# EAGLE design PSU-Control (EAGLE 8.2.0)
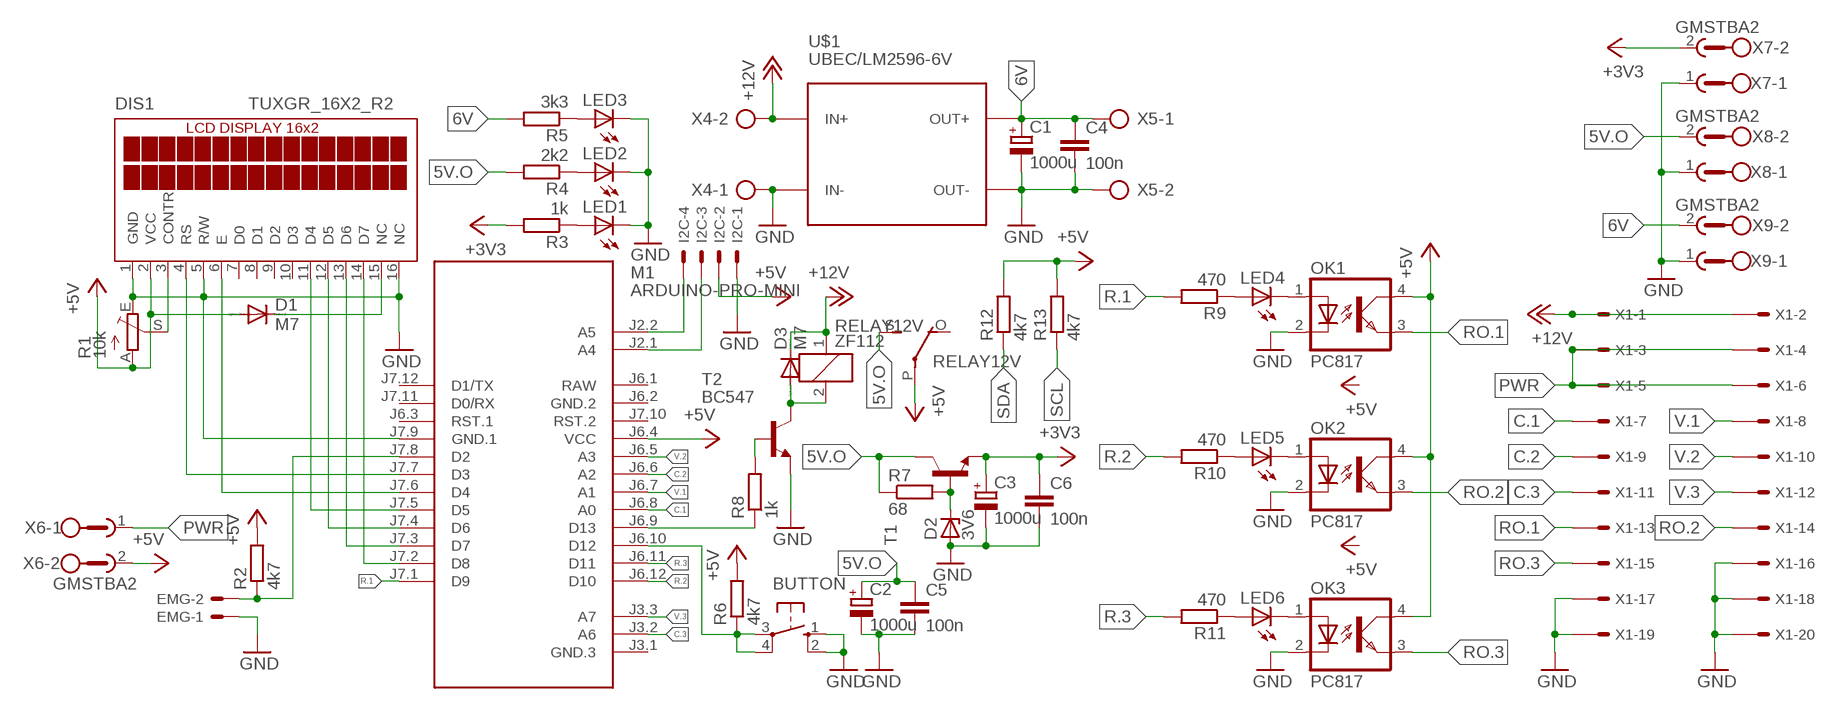
[diagram p0: schematic, sheet 1]

## Parts
BUTTON  40-XX  [B3F-40XX]
C1  1000u  CPOL-EUE5-10.5  [E5-10,5]
C2  1000u  CPOL-EUE5-10.5  [E5-10,5]
C3  1000u  CPOL-EUE5-10.5  [E5-10,5]
C4  100n  C-EUC0805K  [C0805K]
C5  100n  C-EUC0805K  [C0805K]
C6  100n  C-EUC0805K  [C0805K]
D1  M7  DIODE-DO214AA  [DO214AA]
D2  3V6  ZENER-DIODEZD-7.5  [ZDIO-7.5]
D3  M7  DIODE-DO214AA  [DO214AA]
DIS1  TUXGR_16X2_R2  [TUXGR_16X2_R2]
EMG  22-23-2021  [22-23-2021]
I2C  22-23-2041  [22-23-2041]
LED1  LEDCHIPLED_1206  [CHIPLED_1206]
LED2  LEDCHIPLED_1206  [CHIPLED_1206]
LED3  LEDCHIPLED_1206  [CHIPLED_1206]
LED4  LEDCHIPLED_1206  [CHIPLED_1206]
LED5  LEDCHIPLED_1206  [CHIPLED_1206]
LED6  LEDCHIPLED_1206  [CHIPLED_1206]
M1  ARDUINO-PRO-MINI  ARDUINO-PRO-MINI-5.0V#NP  [ARDUINO-PRO-MINI#NP]
OK1  PC817  [DIL04]
OK2  PC817  [DIL04]
OK3  PC817  [DIL04]
R1  10k  TRIM_EU-RJ9W  [RJ9W]
R2  4k7  R-EU_R0805  [R0805]
R3  1k  R-EU_R0805  [R0805]
R4  2k2  R-EU_R0805  [R0805]
R5  3k3  R-EU_R0805  [R0805]
R6  4k7  R-EU_R0805  [R0805]
R7  68  R-EU_R0805  [R0805]
R8  1k  R-EU_R0805  [R0805]
R9  470  R-EU_R0805  [R0805]
R10  470  R-EU_R0805  [R0805]
R11  470  R-EU_R0805  [R0805]
R12  4k7  R-EU_R0805  [R0805]
R13  4k7  R-EU_R0805  [R0805]
RELAY12V  ZF112  [ZF112]
T1  -NPN-TO220V  [TO220V]
T2  BC547  [TO92]
U$1  UBEC/LM2596-6V  DC-DC-STEP-DOWN-LM2596  [DC-DC-STEP-DOWN-LM2596]
X1  057-020-1  [057-020-1]
X4  AK300/2  [AK300/2]
X5  AK300/2  [AK300/2]
X6  GMSTBA2  [GMSTBA2]
X7  GMSTBA2  [GMSTBA2]
X8  GMSTBA2  [GMSTBA2]
X9  GMSTBA2  [GMSTBA2]

## Nets
5V.O: C2.+ C5.1 R4.2 R7.1 RELAY12V.S(2:S) T1.2(C) X8.2
6V: C1.+ C4.1 R5.2 U$1.OUT+ X5.1 X9.2
+3V3: C3.+ C6.1 R3.2 T1.3(E) X7.2
+5V: D1.A DIS1.2(VCC) I2C.2 M1.J6.4(VCC) OK1.4(COL) OK2.4(COL) OK3.4(COL) R1.A R2.2 R6.2 R12.2 R13.2 RELAY12V.P(2:P) X6.2
+12V: D3.C RELAY12V.1 U$1.IN+ X1.1 X1.2 X4.2
C.1: M1.J6.8(A0) X1.7
C.2: M1.J6.6(A2) X1.9
C.3: M1.J3.2(A6) X1.11
GND: BUTTON.1(S) BUTTON.2(S1) C1.- C2.- C3.- C4.2 C5.2 C6.2 D2.A DIS1.1(GND) DIS1.5(R/W) DIS1.16(NC) EMG.1 I2C.1 LED1.C LED2.C LED3.C M1.J7.9(GND.1) OK1.2(C) OK2.2(C) OK3.2(C) R1.E T2.1(E) U$1.IN- U$1.OUT- X1.16 X1.17 X1.18 X1.19 X1.20 X4.1 X5.2 X7.1 X8.1 X9.1
N$1: EMG.2 M1.J7.8(D2) R2.1
N$2: D1.C DIS1.15(NC)
N$3: DIS1.4(RS) M1.J7.7(D3)
N$4: DIS1.3(CONTR) R1.S
N$5: DIS1.6(E) M1.J7.6(D4)
N$6: DIS1.11(D4) M1.J7.5(D5)
N$7: LED4.C OK1.1(A)
N$8: LED5.A R10.1
N$9: DIS1.12(D5) M1.J7.4(D6)
N$10: DIS1.13(D6) M1.J7.3(D7)
N$11: DIS1.14(D7) M1.J7.2(D8)
N$12: BUTTON.3(P) BUTTON.4(P1) M1.J6.10(D12) R6.1
N$13: LED1.A R3.1
N$14: LED2.A R4.1
N$15: LED3.A R5.1
N$16: D2.C R7.2 T1.1(B)
N$17: LED5.C OK2.1(A)
N$18: D3.A RELAY12V.2 T2.3(C)
N$19: M1.J6.9(D13) R8.1
N$20: R8.2 T2.2(B)
N$21: LED6.A R11.1
N$22: LED4.A R9.1
N$23: LED6.C OK3.1(A)
PWR: X1.3 X1.4 X1.5 X1.6 X6.1
R.1: M1.J7.1(D9) R9.2
R.2: M1.J6.12(D10) R10.2
R.3: M1.J6.11(D11) R11.2
RO.1: OK1.3(EMIT) X1.13
RO.2: OK2.3(EMIT) X1.14
RO.3: OK3.3(EMIT) X1.15
SCL: I2C.4 M1.J2.2(A5) R13.1
SDA: I2C.3 M1.J2.1(A4) R12.1
V.1: M1.J6.7(A1) X1.8
V.2: M1.J6.5(A3) X1.10
V.3: M1.J3.3(A7) X1.12
Unconnected: DIS1.7(D0) DIS1.8(D1) DIS1.9(D2) DIS1.10(D3) M1.J3.1(GND.3) M1.J6.3(RST.1) M1.J7.10(RST.2) M1.J7.11(D0/RX) M1.J7.12(D1/TX) RELAY12V.O(2:O)

## Power pins joined to a net without a drawn wire
GND.2: M1.J6.2(GND.2)
RAW: M1.J6.1(RAW)

## Library data of the parts
BUTTON = switch-omron:40-XX: OMRON SWITCH; MF: OMRON COMPONENTS USA; MPN: B3F-4000; OC_FARNELL: 176434; OC_NEWARK: 36K3105
C1-C3 = rcl:CPOL-EU: POLARIZED CAPACITOR, European symbol
C4-C6 = rcl:C-EU: CAPACITOR, European symbol
D1 D3 = diode:DIODE-: DIODE
D2 = diode:ZENER-DIODE: Z-Diode
DIS1 = display-lcd:TUXGR_16X2_R2: Tuxgraphics LCD display 16x2 characters reflective, without background light Source: tuxgr_12x2_r2.pdf; OC_FARNELL: unknown; OC_NEWARK: unknown
EMG = con-molex:22-23-2021: .100" (2.54mm) Center Header - 2 Pin; MF: MOLEX; MPN: 22-23-2021; OC_FARNELL: 1462926; OC_NEWARK: 25C3832
I2C = con-molex:22-23-2041: .100" (2.54mm) Center Header - 4 Pin; MF: MOLEX; MPN: 22-23-2041; OC_FARNELL: 1462920; OC_NEWARK: 38C0355
LED1-LED6 = led:LED: LED OSRAM: - CHIPLED LG R971, LG N971, LY N971, LG Q971, LY Q971, LO R971, LY R971 LH N974, LH R974 LS Q976, LO Q976, LY Q976 LO Q996 - Hyper CHIPLED LW Q18S LB Q993, LB Q99A, LB R99A - SideLED LS A670, LO A670, LY A670, LG A670, LP A670 LB A673, LV A673, LT A673, LW A673 LH A674 LY A675 LS A676, LA A676, LO A676, LY A676, LW A676 LS A679, LY A679, LG A679 - Hyper Micro SIDELED® LS Y876, LA Y876, LO Y876, LY Y876 LT Y87S - SmartLED LW L88C, LW L88S LB L89C, LB L89S, LG L890 LS L89K, LO L89K, LY L89K LS L896, LA L896, LO L896, LY L896 - TOPLED LS T670, LO T670, LY T670, LG T670, LP T670 LSG T670, LSP T670, LSY T670, LOP T670, LYG T670 LG T671, LOG T671, LSG T671 LB T673, LV T673, LT T673, LW T673 LH T674 LS T676, LA T676, LO T676, LY T676, LB T676, LH T676, LSB T676, LW T676 LB T67C, LV T67C, LT T67C, LS T67K, LO T67K, LY T67K, LW E67C LS E67B, LA E67B, LO E67B, LY E67B, LB E67C, LV E67C, LT E67C LW T67C LS T679, LY T679, LG T679 LS T770, LO T770, LY T770, LG T770, LP T770 LB T773, LV T773, LT T773, LW T773 LH T774 LS E675, LA E675, LY E675, LS T675 LS T776, LA T776, LO T776, LY T776, LB T776 LHGB T686 LT T68C, LB T68C - Hyper Mini TOPLED® LB M676 - Mini TOPLED Santana® LG M470 LS M47K, LO M47K, LY M47K Source: http://www.osram.convergy.de LUXEON: - LUMILED® LXK2-PW12-R00, LXK2-PW12-S00, LXK2-PW14-U00, LXK2-PW14-V00 LXK2-PM12-R00, LXK2-PM12-S00, LXK2-PM14-U00 LXK2-PE12-Q00, LXK2-PE12-R00, LXK2-PE12-S00, LXK2-PE14-T00, LXK2-PE14-U00 LXK2-PB12-K00, LXK2-PB12-L00, LXK2-PB12-M00, LXK2-PB14-N00, LXK2-PB14-P00, LXK2-PB14-Q00 LXK2-PR12-L00, LXK2-PR12-M00, LXK2-PR14-Q00, LXK2-PR14-R00 LXK2-PD12-Q00, LXK2-PD12-R00, LXK2-PD12-S00 LXK2-PH12-R00, LXK2-PH12-S00 LXK2-PL12-P00, LXK2-PL12-Q00, LXK2-PL12-R00 Source: www.luxeon.com KINGBRIGHT: KA-3528ASYC Source: www.kingbright.com
M1 = diy-modules:ARDUINO-PRO-MINI-*#NP: Arduino Pro Mini (and compatible devices) without programming pads More details available here: https://www.arduino.cc/en/Main/ArduinoBoardProMini Click here to find device on ebay.com <http://www.ebay.com/sch/arduino+pro+mini>
OK1-OK3 = optocoupler:PC817: SHARP OPTO COUPLER; MPN: PC817X4J000F; OC_FARNELL: 9707727; OC_NEWARK: 97K7059
R1 = pot:TRIM_EU-: POTENTIOMETER
R2-R13 = rcl:R-EU_: RESISTOR, European symbol
RELAY12V = relay:ZF112: RELAY 1 x switch; OC_FARNELL: unknown; OC_NEWARK: unknown
T1 = transistor:*-NPN-: NPN Transistror BF959 corrected 2008.03.06
T2 = transistor:BC547: NPN TRANSISTOR
U$1 = diy-modules:DC-DC-STEP-DOWN-LM2596: DC/DC Step-Down Regulator based on LM2596-ADJ chip LM2596 datasheet available here: http://www.ti.com/lit/ds/symlink/lm2596.pdf Click here to find device on ebay.com <http://www.ebay.com/sch/lm2596+power+regulator>
X1 = con-panduit:057-020-: CONNECTOR 20-pin series 057 contact pc board low profile headers; OC_FARNELL: unknown; OC_NEWARK: unknown
X4 X5 = con-ptr500:AK300/2: CONNECTOR; OC_FARNELL: unknown; OC_NEWARK: unknown
X6-X9 = con-phoenix-762:GMSTBA2: PHOENIX; MF: FARNELL; MPN: 1757242; OC_FARNELL: 3705171; OC_NEWARK: 71C4161

## Board
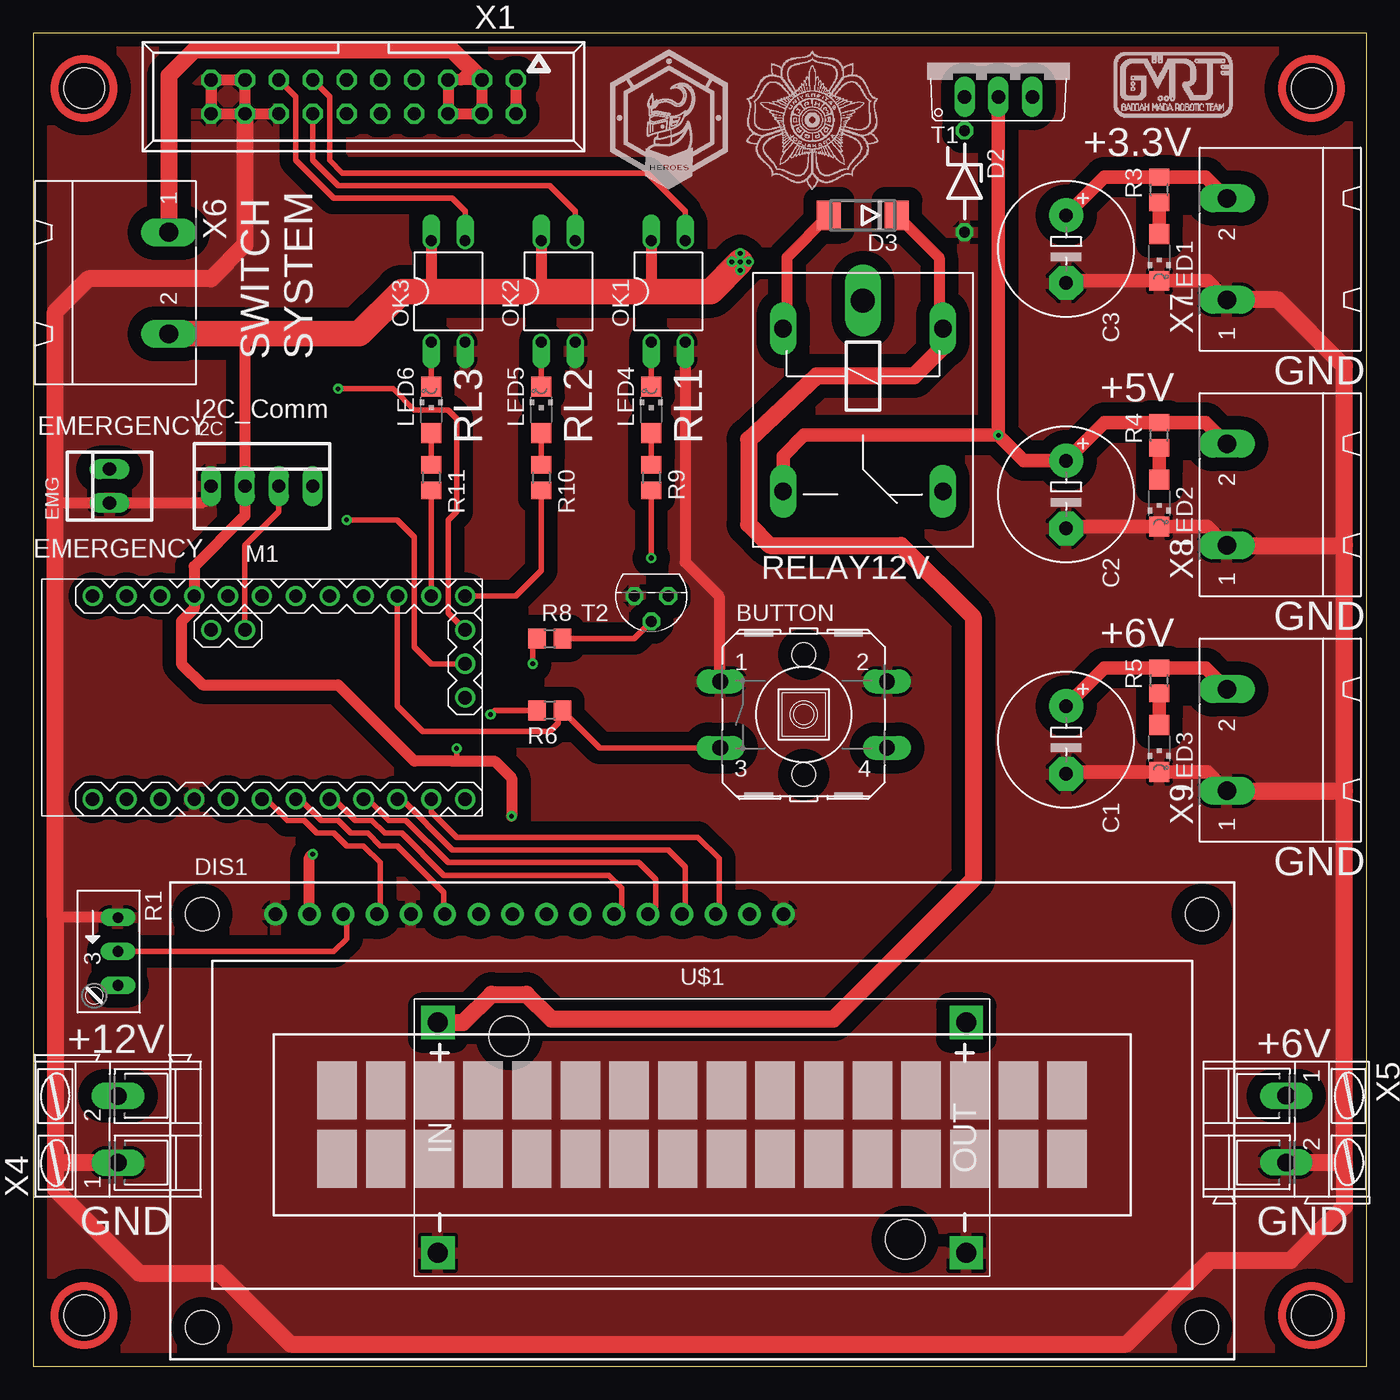
[diagram p1: board, top side]
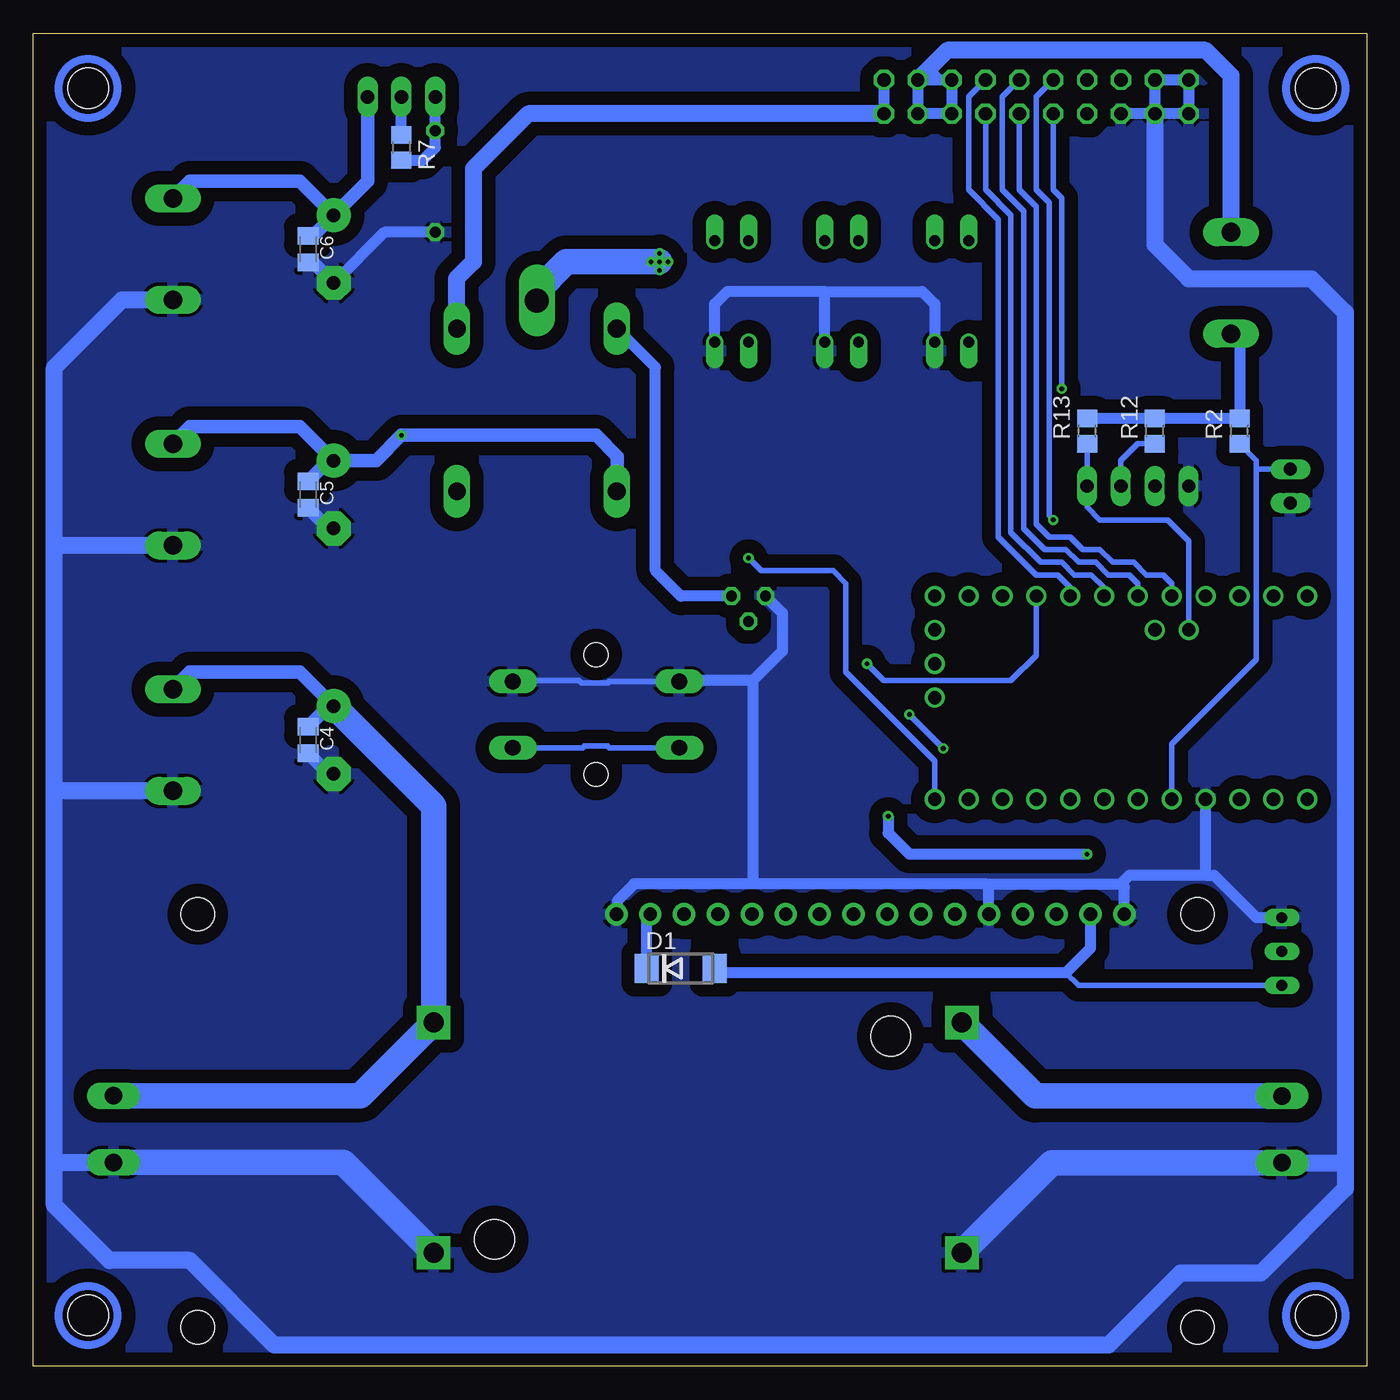
[diagram p2: board, bottom side, seen from below]

Size 100 x 100 mm. Coordinates in mm from the lower left corner, seen from the top.
Outline: 0,0 100,0 100,100 0,100 0,0
Copper layers (1*16): Top 0.035mm / dielectric 1.5mm / Bottom 0.035mm
Design rules "default": minimum track width 6mil, minimum drill 0.35mm, track to track 6mil, track to pad 6mil, pad to pad 6mil, via to via 6mil, smd to smd 6mil, copper to edge 40mil, drill to drill 6mil, minimum pad ring 10mil, minimum via ring 8mil, stop-mask expansion 4mil, vias tented up to drill 0mil, thermal gap 10mil

### Footprints (pad centres in the part's own frame; a part is rotated, then mirrored left to right if it is on the bottom)
B3F-40XX = drill 1.194 long: 1 -6.248,2.489; 2 6.248,2.489; 3 -6.248,-2.489; 4 6.248,-2.489 | hole 1.803: 0,-4.496; 0,4.496
E5-10,5 = drill 1.016 pad 2.54: + -2.54,0 | drill 1.016 pad 2.54 octagon: - 2.54,0
C0805K = smd 1.3 x 1.6: 1 -1,0; 2 1,0
DO214AA = smd 1.8 x 2.2: A 2.55,0; C -2.55,0
ZDIO-7.5 = drill 0.813 octagon: A 3.81,0; C -3.81,0
TUXGR_16X2_R2 = drill 1 pad 1.676: 1 -32,15.5; 2 -29.46,15.5; 3 -26.92,15.5; 4 -24.38,15.5; 5 -21.84,15.5; 6 -19.3,15.5; 7 -16.76,15.5; 8 -14.22,15.5; 9 -11.68,15.5; 10 -9.14,15.5; 11 -6.6,15.5; 12 -4.06,15.5; 13 -1.52,15.5; 14 1.02,15.5; 15 3.56,15.5; 16 6.1,15.5 | hole 2.5: -37.5,-15.5; 37.5,-15.5; -37.5,15.5; 37.5,15.5
22-23-2021 = drill 1 long: 1 -1.27,0; 2 1.27,0
22-23-2041 = drill 1 long: 1 -3.81,0; 2 -1.27,0; 3 1.27,0; 4 3.81,0
CHIPLED_1206 = smd 1.5 x 1.5: A 0,-1.75; C 0,1.75
ARDUINO-PRO-MINI#NP = drill 1: J2.1 -1.27,5.08; J2.2 -3.81,5.08; J3.1 15.24,0; J3.2 15.24,2.54; J3.3 15.24,5.08; J6.1 -12.7,7.62; J6.2 -10.16,7.62; J6.3 -7.62,7.62; J6.4 -5.08,7.62; J6.5 -2.54,7.62; J6.6 0,7.62; J6.7 2.54,7.62; J6.8 5.08,7.62; J6.9 7.62,7.62; J6.10 10.16,7.62; J6.11 12.7,7.62; J6.12 15.24,7.62; J7.1 15.24,-7.62; J7.2 12.7,-7.62; J7.3 10.16,-7.62; J7.4 7.62,-7.62; J7.5 5.08,-7.62; J7.6 2.54,-7.62; J7.7 0,-7.62; J7.8 -2.54,-7.62; J7.9 -5.08,-7.62; J7.10 -7.62,-7.62; J7.11 -10.16,-7.62; J7.12 -12.7,-7.62
DIL04 = drill 0.813 offset: 1 -1.27,-3.81; 2 1.27,-3.81; 3 1.27,3.81; 4 -1.27,3.81
RJ9W = drill 0.813 long: A 2.54,0.635; E -2.54,0.635; S 0,0.635
R0805 = smd 1.3 x 1.5: 1 -0.95,0; 2 0.95,0
ZF112 = drill 1.321 long: 1 -6.096,5.994; 2 -6.096,-5.994; O 6.096,5.994; S 6.096,-5.994 | drill 1.803 long: P -8.204,0
TO220V = drill 1.016 long: 1 -2.54,-2.54; 2 0,-2.54; 3 2.54,-2.54
TO92 = drill 0.813 octagon: 1 1.27,0; 2 0,1.905; 3 -1.27,0
DC-DC-STEP-DOWN-LM2596 = drill 1.5 pad 2.5 square: IN+ -19.812,8.636; IN- -19.812,-8.636; OUT+ 19.812,8.636; OUT- 19.812,-8.636 | hole 3: -14.478,7.62; 15.24,-7.62
HOLE-3MM = hole 3.05: 0,0
057-020-1 = drill 1 octagon: 1 -11.43,-1.27; 2 -11.43,1.27; 3 -8.89,-1.27; 4 -8.89,1.27; 5 -6.35,-1.27; 6 -6.35,1.27; 7 -3.81,-1.27; 8 -3.81,1.27; 9 -1.27,-1.27; 10 -1.27,1.27; 11 1.27,-1.27; 12 1.27,1.27; 13 3.81,-1.27; 14 3.81,1.27; 15 6.35,-1.27; 16 6.35,1.27; 17 8.89,-1.27; 18 8.89,1.27; 19 11.43,-1.27; 20 11.43,1.27
AK300/2 = drill 1.321 long: 1 -2.515,0; 2 2.489,0
GMSTBA2 = drill 1.397 long: 1 -3.81,5.08; 2 3.81,5.08

### Placement (x,y rotation side)
BUTTON  57.78,48.9 0 top
C1  77.47,46.99 270 top
C2  77.47,65.41 270 top
C3  77.47,83.82 270 top
C4  79.38,46.99 270 bottom
C5  79.38,65.41 270 bottom
C6  79.38,83.82 270 bottom
D1  51.43,29.84 0 bottom
D2  69.85,88.9 270 top
D3  62.23,86.36 180 top
DIS1  50.16,18.41 0 top
EMG  5.71,66.04 90 top
I2C  17.14,66.04 0 top
LED1  84.45,83.19 180 top
LED2  84.45,64.77 180 top
LED3  84.45,46.35 180 top
LED4  46.35,71.76 0 top
LED5  38.1,71.76 0 top
LED6  29.84,71.76 0 top
M1  17.14,50.16 0 top
OK1  47.62,80.65 0 top
OK2  39.37,80.65 0 top
OK3  31.12,80.65 0 top
R1  5.71,31.11 270 top
R2  9.53,70.17 90 bottom
R3  84.45,88.27 90 top
R4  84.45,69.85 90 top
R5  84.45,51.44 90 top
R6  38.73,49.21 180 top
R7  72.39,91.44 270 bottom
R8  38.73,54.61 0 top
R9  46.35,66.68 270 top
R10  38.1,66.68 270 top
R11  29.84,66.68 270 top
R12  15.88,70.17 90 bottom
R13  20.96,70.17 90 bottom
RELAY12V  62.23,71.76 270 top
T1  72.39,97.79 0 top
T2  46.35,57.78 180 top
U$1  50.16,17.14 0 top
U$2  [HOLE-3MM]  3.81,95.89 0 top
U$3  [HOLE-3MM]  3.81,3.81 0 top
U$4  [HOLE-3MM]  95.89,95.89 0 top
U$5  [HOLE-3MM]  95.89,3.81 0 top
X1  24.77,95.25 180 top
X4  6.35,17.78 90 top
X5  93.98,17.78 270 top
X6  5.08,81.28 270 top
X7  94.62,83.82 90 top
X8  94.62,65.41 90 top
X9  94.62,46.99 90 top

### Tracks (layer width: path | path; a pad name or v marks a point on that pad's centre or on a via)
5V.O  (via drill 0.35)
  Top 1.016: X8.2 87.95,70.8 R4.2 80.33,70.8 C2.+ 74.3,67.95 v72.39,69.85 | RELAY12V.S 56.24,68.3 57.79,69.85 v72.39,69.85 | T1.2 v72.39,69.85
  Bottom 0.813: R7.1 T1.2
  Bottom 1.016: C2.+ 77.84,67.95 C5.1 | C2.+ 74.3,67.95 v72.39,69.85 57.79,69.85 56.2,68.26 56.2,65.72 | C2.+ 80.01,70.49 88.27,70.49 X8.2
6V
  Top 1.016: X9.2 87.95,52.39 R5.2 80.33,52.39 C1.+
  Bottom 1.016: C4.1 77.84,49.53 C1.+ 80.01,52.07 88.27,52.07 X9.2
  Bottom 1.93: X5.1 75.46,20.29 U$1.OUT+ 69.98,42.04 C1.+
+3V3
  Top 1.016: X7.2 87.95,89.22 R3.2 80.33,89.22 C3.+
  Bottom 1.016: T1.3 74.93,88.9 C3.+ | C6.1 79.01,84.82 C3.+ | C3.+ 80.01,88.9 88.27,88.9 X7.2
+5V  (via drill 0.35)
  Top 0.406: R6.2 34.61,49.21 v34.29,48.9 | v31.75,46.36 31.75,45.72 31.43,45.4
  Top 0.813: OK3.4 29.85,80.65 | OK2.4 38.1,80.65 | OK1.4 46.36,80.65 | 15.88,77.47 I2C.2 15.88,63.82 12.07,60.01 M1.J6.4 12.07,56.83 11.11,55.88 11.11,52.71 12.7,51.12 22.86,51.12 28.58,45.4 31.43,45.4 34.61,45.4 35.88,44.13 v35.88,41.28 | DIS1.2 20.71,38.17 v20.96,38.42
  Top 1.93: X6.2 15.88,77.47 24.45,77.47 27.62,80.65 29.85,80.65 38.1,80.65 46.36,80.65 50.8,80.65 v53.02,82.87
  Bottom 0.406: R1.A 21.59,28.58 22.54,29.53 | v34.29,48.9 v31.75,46.36
  Bottom 0.813: DIS1.2 20.71,31.37 22.54,29.53 48.57,29.53 D1.A | X6.2 9.53,76.84 R2.2 R12.2 R13.2 | v35.88,41.28 35.88,40.01 34.29,38.42 v20.96,38.42
  Bottom 1.93: RELAY12V.P 62.23,80.65 60.01,82.87 v53.66,82.87 v53.02,82.87
+12V
  Top 0.813: D3.C 67.95,83.19 67.95,78.13 RELAY12V.1 | X1.1 X1.2
  Top 1.27: RELAY12V.1 68.22,76.48 66.04,74.3 58.74,74.3 53.66,69.53 53.66,63.18 55.25,61.6 65.09,61.6 70.49,56.2 70.49,36.51 60.01,26.04 38.87,26.04 36.99,27.92 34.38,27.92 32.25,25.78 U$1.IN+
  Bottom 0.813: X1.1 X1.2
  Bottom 1.27: X1.2 62.87,93.98 66.99,89.85 66.99,82.87 68.26,81.6 68.26,77.89 RELAY12V.1
  Bottom 1.93: X4.2 24.84,20.27 U$1.IN+
C.1
  Bottom 0.406: X1.7 29.85,95.25 29.85,88.27 27.62,86.04 27.62,62.23 24.77,59.37 23.18,59.37 22.23,58.42 M1.J6.8
C.2
  Bottom 0.406: X1.9 27.31,95.25 27.31,88.27 25.72,86.68 25.72,62.87 24.13,61.28 22.54,61.28 21.59,60.33 20.32,60.33 19.37,59.37 17.78,59.37 17.15,58.74 M1.J6.6
C.3  (via drill 0.35)
  Top 0.406: v23.5,63.5 27.31,63.5 28.58,62.23 28.58,53.98 29.85,52.71 M1.J3.2
  Bottom 0.406: X1.11 24.77,95.25 24.77,88.27 23.81,87.31 23.81,63.82 v23.5,63.5
GND
  Top 0.813: X1.18 X1.20 X1.19 X1.17 X1.18 | X1.18 X1.16 | OK1.2 48.9,60.33 51.44,57.79 51.44,51.49 BUTTON.1 | 1.65,64.77 EMG.1 12.7,64.77 13.34,65.41 I2C.1 | 1.68,15.27 1.65,15.24 | 98.3,15.29 98.35,15.24 | R1.E 1.65,33.66
  Top 1.016: X7.1 88.11,81.44 LED1.C 77.63,81.44 C3.- | X8.1 88.11,63.02 LED2.C 77.63,63.02 C2.- | X9.1 88.11,44.61 LED3.C 77.63,44.61 C1.-
  Top 1.27: X1.18 15.88,84.14 13.34,81.6 4.13,81.6 1.65,79.12 1.65,64.77 1.65,33.66 1.65,15.24 1.65,13.27 7.94,6.99 13.97,6.99 19.3,1.65 81.98,1.65 88.27,7.94 94.3,7.94 98.35,11.99 98.35,15.24 98.35,43.18 | 98.35,43.18 98.35,61.6 | 98.35,61.6 98.35,75.01 93.35,80.01 X7.1 | X8.1 98.35,61.6 | X9.1 98.35,43.18 | X4.1 1.68,15.27 | X5.2 98.3,15.29
  Bottom 0.406: BUTTON.1 56.79,51.38 56.91,51.27 58.89,51.27 59.06,51.44 63.98,51.44 BUTTON.2
  Bottom 0.813: D2.A 73.66,85.09 C3.- | DIS1.1 18.17,35.95 18.42,36.2 | 12.07,36.83 M1.J7.9 | 12.07,36.83 17.78,36.83 18.42,36.2 | 12.07,36.83 11.43,36.83 8.26,33.66 R1.E | X1.18 X1.17 X1.19 X1.20 X1.18 | X1.18 X1.16 | OK1.2 48.9,79.69 47.94,80.65 40.64,80.65 | 40.64,80.65 33.34,80.65 32.39,79.69 OK3.2 | OK2.2 40.64,80.65 | T2.1 43.82,56.52 43.82,53.66 46.04,51.44 | 46.04,51.44 51.49,51.44 BUTTON.1 | DIS1.16 56.2,33.98 56.2,34.93 54.93,36.2 46.04,36.2 | 28.58,36.2 46.04,36.2 | 28.58,36.2 18.42,36.2 | 46.04,51.44 46.04,36.2 | 28.58,36.2 28.33,35.95 DIS1.5
  Bottom 1.016: C6.2 79.01,82.82 C3.- | C2.- 77.84,62.87 C5.2 | C1.- 77.84,44.45 C4.2
  Bottom 1.27: X1.18 15.88,84.14 13.34,81.6 4.13,81.6 1.59,79.06 1.59,15.24 | 1.59,15.24 1.59,13.34 7.94,6.99 13.97,6.99 19.37,1.59 81.92,1.59 88.27,7.94 94.3,7.94 98.43,12.07 98.43,15.24 | 98.43,15.24 98.43,43.18 | 98.43,43.18 98.43,61.6 | 98.43,61.6 98.43,74.93 93.35,80.01 X7.1 | X8.1 98.43,61.6 | X9.1 98.43,43.18 | 93.98,15.24 98.43,15.24 | 6.35,15.24 1.59,15.24
  Bottom 1.93: X4.1 23.6,15.27 U$1.IN- | X5.2 76.76,15.29 U$1.OUT-
  pour Bottom (isolate 1.016): 0,99.7 0,0 100.01,0 100.01,100.01 0.32,100.01
  pour Top (isolate 1.016): 100.01,100.01 -0.95,100.01 -0.95,0 100.01,0
N$1
  Bottom 0.406: M1.J7.8 14.61,46.67 8.26,53.02 8.26,67.31 | 9.53,68.9 R2.1 8.26,67.95 8.26,67.31 | EMG.2 8.26,67.31
N$2
  Bottom 0.813: D1.C 53.99,33.66 DIS1.15
N$3
  Top 0.406: M1.J7.7 17.46,42.55 19.05,40.96 20.32,40.96 21.27,40.01 22.54,40.01 23.5,39.05 24.77,39.05 26.04,37.78 26.04,34.17 DIS1.4
N$4
  Top 0.406: R1.S 22.54,31.12 23.5,32.07 23.5,33.67 DIS1.3
N$5
  Top 0.406: M1.J7.6 20,42.55 21.59,40.96 22.86,40.96 23.81,40.01 25.08,40.01 26.04,39.05 27.31,39.05 30.8,35.56 30.8,33.98 DIS1.6
N$6
  Top 0.406: M1.J7.5 22.54,42.55 24.13,40.96 25.4,40.96 26.35,40.01 27.62,40.01 30.8,36.83 43.18,36.83 44.13,35.88 44.13,34.48 DIS1.11
N$7
  Top 0.406: OK1.1 LED4.C
N$8
  Top 0.406: LED5.A R10.1
N$9
  Top 0.406: M1.J7.4 25.08,42.55 26.67,40.96 27.94,40.96 31.12,37.78 45.4,37.78 46.67,36.51 46.67,34.48 DIS1.12
N$10
  Top 0.406: M1.J7.3 27.62,42.55 31.43,38.74 47.63,38.74 48.9,37.47 48.9,34.17 DIS1.13
N$11
  Top 0.406: M1.J7.2 29.85,41.59 31.75,39.69 49.85,39.69 51.44,38.1 51.44,34.17 DIS1.14
N$12
  Top 0.406: BUTTON.3 42.49,46.41 R6.1 39.37,48.9 39.37,48.26 38.74,47.63 29.21,47.63 27.31,49.53 M1.J6.10
  Bottom 0.406: BUTTON.4 58.78,46.41 58.66,46.52 56.91,46.52 56.79,46.41 BUTTON.3
N$13
  Top 1.016: R3.1 LED1.A
N$14
  Top 1.016: R4.1 LED2.A
N$15
  Top 1.016: R5.1 LED3.A
N$16
  Bottom 0.813: T1.1 D2.C 69.85,91.44 70.8,90.49 R7.2
N$17
  Top 0.406: OK2.1 LED5.C
N$18
  Top 0.813: D3.A 56.52,83.19 56.52,78.13 RELAY12V.2
  Bottom 0.813: T2.3 51.44,57.79 53.34,59.69 53.34,74.96 RELAY12V.2
N$19  (via drill 0.35)
  Top 0.406: v37.47,52.71 37.47,54.29 R8.1
  Bottom 0.406: M1.J6.9 24.77,53.34 26.67,51.44 36.2,51.44 v37.47,52.71
N$20
  Top 0.406: R8.2 45.09,54.61 T2.2
N$21
  Top 0.406: LED6.A R11.1
N$22
  Top 0.406: LED4.A R9.1
N$23
  Top 0.406: OK3.1 LED6.C
N$24  (via drill 0.35)
  other vias: 53.02,83.5
N$25  (via drill 0.35)
  other vias: 52.39,82.87
N$26  (via drill 0.35)
  other vias: 53.02,82.23
PWR
  Top 0.813: 32.07,96.52 X1.3 X1.4 X1.6 X1.5 32.07,96.52 | 32.07,96.52 32.7,97.16
  Top 1.27: X1.3 31.43,98.74 12.07,98.74 10.16,96.84 X6.1
  Bottom 0.813: 32.07,96.52 X1.3 X1.4 X1.6 X1.5 32.07,96.52 | 32.07,96.52 32.7,97.16
  Bottom 1.27: X6.1 10.16,96.84 12.07,98.74 31.43,98.74 X1.3
R.1  (via drill 0.35)
  Top 0.406: R9.2 v46.36,60.64
  Bottom 0.406: v46.36,60.64 45.4,59.69 40.01,59.69 39.05,58.74 39.05,52.07 32.39,45.4 M1.J7.1
R.2
  Top 0.406: M1.J6.12 36.2,57.79 38.1,59.69 R10.2
R.3
  Top 0.406: M1.J6.11 R11.2
RO.1
  Top 0.406: X1.13 22.23,95.25 22.23,90.49 23.18,89.54 46.04,89.54 48.9,86.68 OK1.3
RO.2
  Top 0.406: X1.14 20.96,90.49 22.86,88.58 38.74,88.58 40.64,86.68 OK2.3
RO.3
  Top 0.406: X1.15 19.69,95.25 19.69,90.49 22.54,87.63 31.43,87.63 32.39,86.68 OK3.3
SCL
  Bottom 0.406: R13.1 I2C.4 20.96,64.45 20,63.5 14.92,63.5 13.34,61.91 M1.J2.2
SDA
  Top 0.406: M1.J2.1 15.88,61.6 18.42,64.14 I2C.3
  Bottom 0.406: R12.1 17.14,69.22 18.42,67.95 I2C.3
V.1
  Bottom 0.406: X1.8 28.58,88.27 26.67,86.36 26.67,62.55 24.45,60.33 22.86,60.33 21.91,59.37 20.64,59.37 19.69,58.42 M1.J6.7
V.2
  Bottom 0.406: X1.10 26.04,88.27 24.77,87 24.77,63.18 23.81,62.23 22.23,62.23 21.27,61.28 20,61.28 19.05,60.33 17.46,60.33 16.51,59.37 15.24,59.37 14.61,58.74 M1.J6.5
V.3  (via drill 0.35)
  Top 0.406: v22.86,73.34 26.99,73.34 28.58,71.76 31.12,71.76 31.75,71.12 31.75,64.14 31.12,63.5 31.12,56.52 M1.J3.3
  Bottom 0.406: X1.12 23.5,88.27 22.86,87.63 v22.86,73.34

### Text on the board
tNames: +3.3V | SWITCH / SYSTEM | GND | +5V | I2C_Comm | EMERGENCY | RL3 | RL2 | RL1 | EMERGENCY | GND | +6V | GND | +12V | +6V | GND | GND